# EAGLE design Zeitschalter_vertikal_SMD (EAGLE 7.2.0)
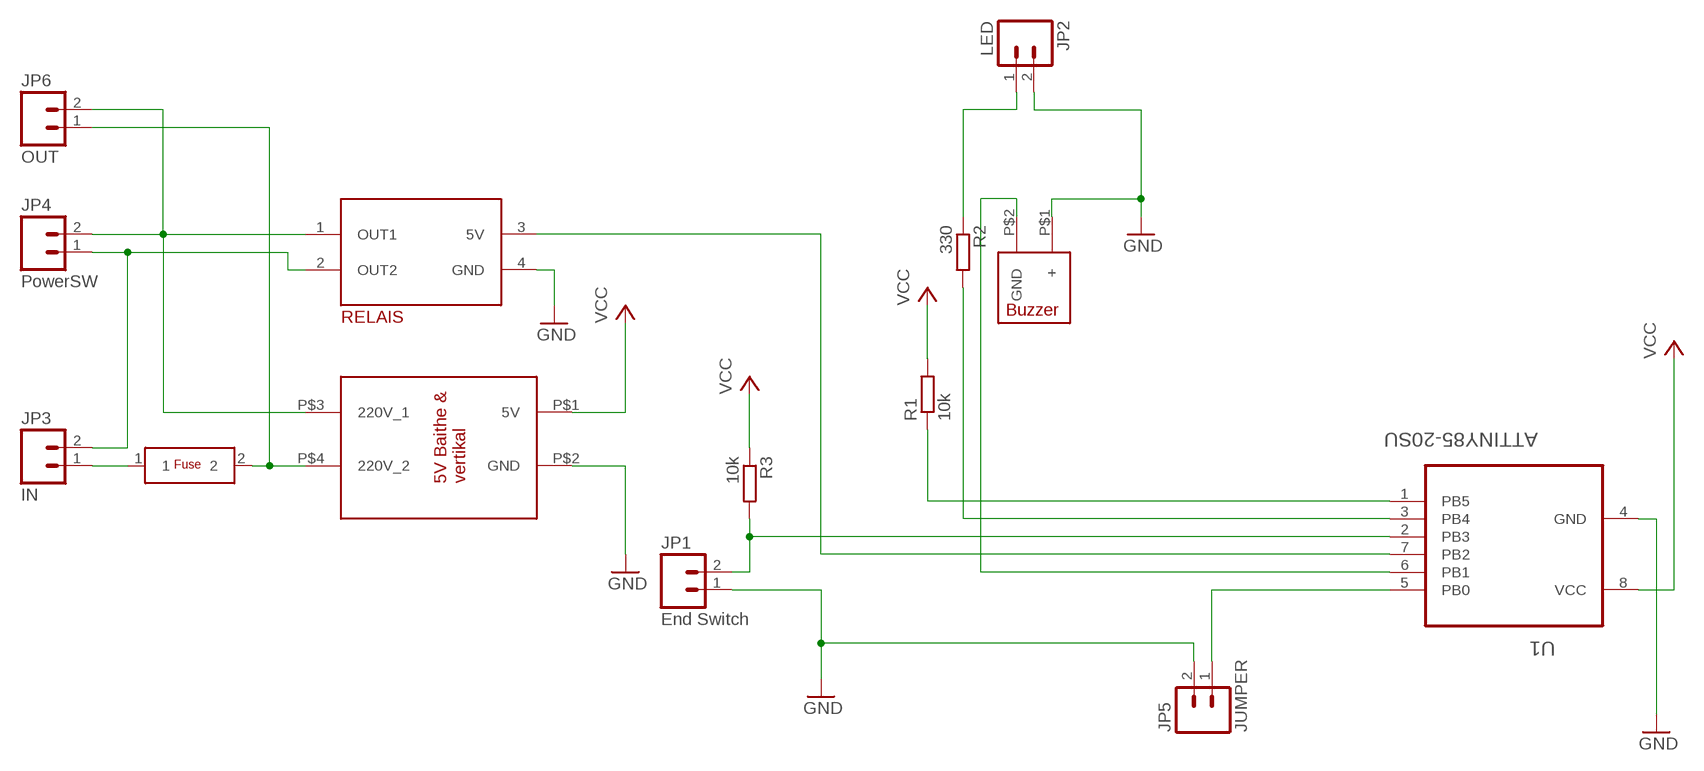
[diagram p0: schematic, sheet 1]

## Parts
FUSE  FUSE  FUSE_RESETABLE  [FUSE_RESETABLE]
JP1  End Switch  M02LOCK_LONGPADS  [1X02_LOCK_LONGPADS]
JP2  LED  M02LOCK_LONGPADS  [1X02_LOCK_LONGPADS]
JP3  IN  M025MM  [SCREWTERMINAL-5MM-2]
JP4  PowerSW  M02LOCK_LONGPADS  [1X02_LOCK_LONGPADS]
JP5  JUMPER  M02LOCK_LONGPADS  [1X02_LOCK_LONGPADS]
JP6  OUT  M025MM  [SCREWTERMINAL-5MM-2]
R1  10k  R-EU_M1206  [M1206]
R2  330  R-EU_M1206  [M1206]
R3  10k  R-EU_M1206  [M1206]
U1  ATTINY85-20SU  [SOIC127P798X216-8N]
U$1  NETZTEIL_VERTIKAL_5V  [NETZTEIL_VERTIKAL_5V]
U$2  OMRON-G3MB-202P  [OMRON-G3MB-202P]
U$3  BUZZER  [BUZZER]

## Nets
GND: JP1.1 JP2.2 JP5.2 U1.4(GND) U$1.P$2(GND) U$2.4(GND) U$3.P$1(+)
N$1 [220V]: FUSE.1 JP3.1
N$2 [220V]: JP4.2 JP6.2 U$1.P$3(220V_1) U$2.1(OUT1)
N$3: R2.2 U1.3(PB4)
N$4: JP1.2 R3.2 U1.2(PB3)
N$5: JP5.1 U1.5(PB0)
N$10 [220V]: FUSE.2 JP6.1 U$1.P$4(220V_2)
N$11: R1.1 U1.1(PB5)
N$13: JP2.1 R2.1
N$14: U1.6(PB1) U$3.P$2(GND)
N$15: U1.7(PB2) U$2.3(5V)
N$17 [220V]: JP3.2 JP4.1 U$2.2(OUT2)
VCC: R1.2 R3.1 U1.8(VCC) U$1.P$1(5V)

## Library data of the parts
FUSE = ASP_Library:FUSE_RESETABLE
JP1 JP2 JP4 JP5 = SparkFun-Connectors:M02: Standard 2-pin 0.1" header. Use with - straight break away headers ( PRT-00116) - right angle break away headers (PRT-00553) - swiss pins (PRT-00743) - machine pins (PRT-00117) - female headers (PRT-00115) Molex polarized connector foot print use with: PRT-08233 with associated crimp pins and housings. 2.54_SCREWTERM for use with PRT-10571. 3.5mm Screw Terminal footprints for PRT-08084 5mm Screw Terminal footprints for use with PRT-08432
JP3 JP6 = ASP_Library:M02: Standard 2-pin 0.1" header. Use with - straight break away headers ( PRT-00116) - right angle break away headers (PRT-00553) - swiss pins (PRT-00743) - machine pins (PRT-00117) - female headers (PRT-00115) Molex polarized connector foot print use with: PRT-08233 with associated crimp pins and housings. 2.54_SCREWTERM for use with PRT-10571. 3.5mm Screw Terminal footprints for PRT-08084 5mm Screw Terminal footprints for use with PRT-08432; STOREFRONT_ID: PRT-08432
R1-R3 = rcl:R-EU_: RESISTOR, European symbol
U1 = Atmel_By_element14_Batch_1-00:ATTINY85-20SU: 8-bit Microcontroller with In-System Programmable Flash; MPN: ATTINY85-20SU; OC_FARNELL: 1455164; OC_NEWARK: 58M3797; PACKAGE: SOIC-8; SUPPLIER: Atmel
U$1 = ASP_Library:NETZTEIL_VERTIKAL_5V
U$2 = ASP_Library:OMRON-G3MB-202P
U$3 = ASP_Library:BUZZER

## Net classes
1 220V: width 0.762 mm, clearance 0.762 mm

## Board
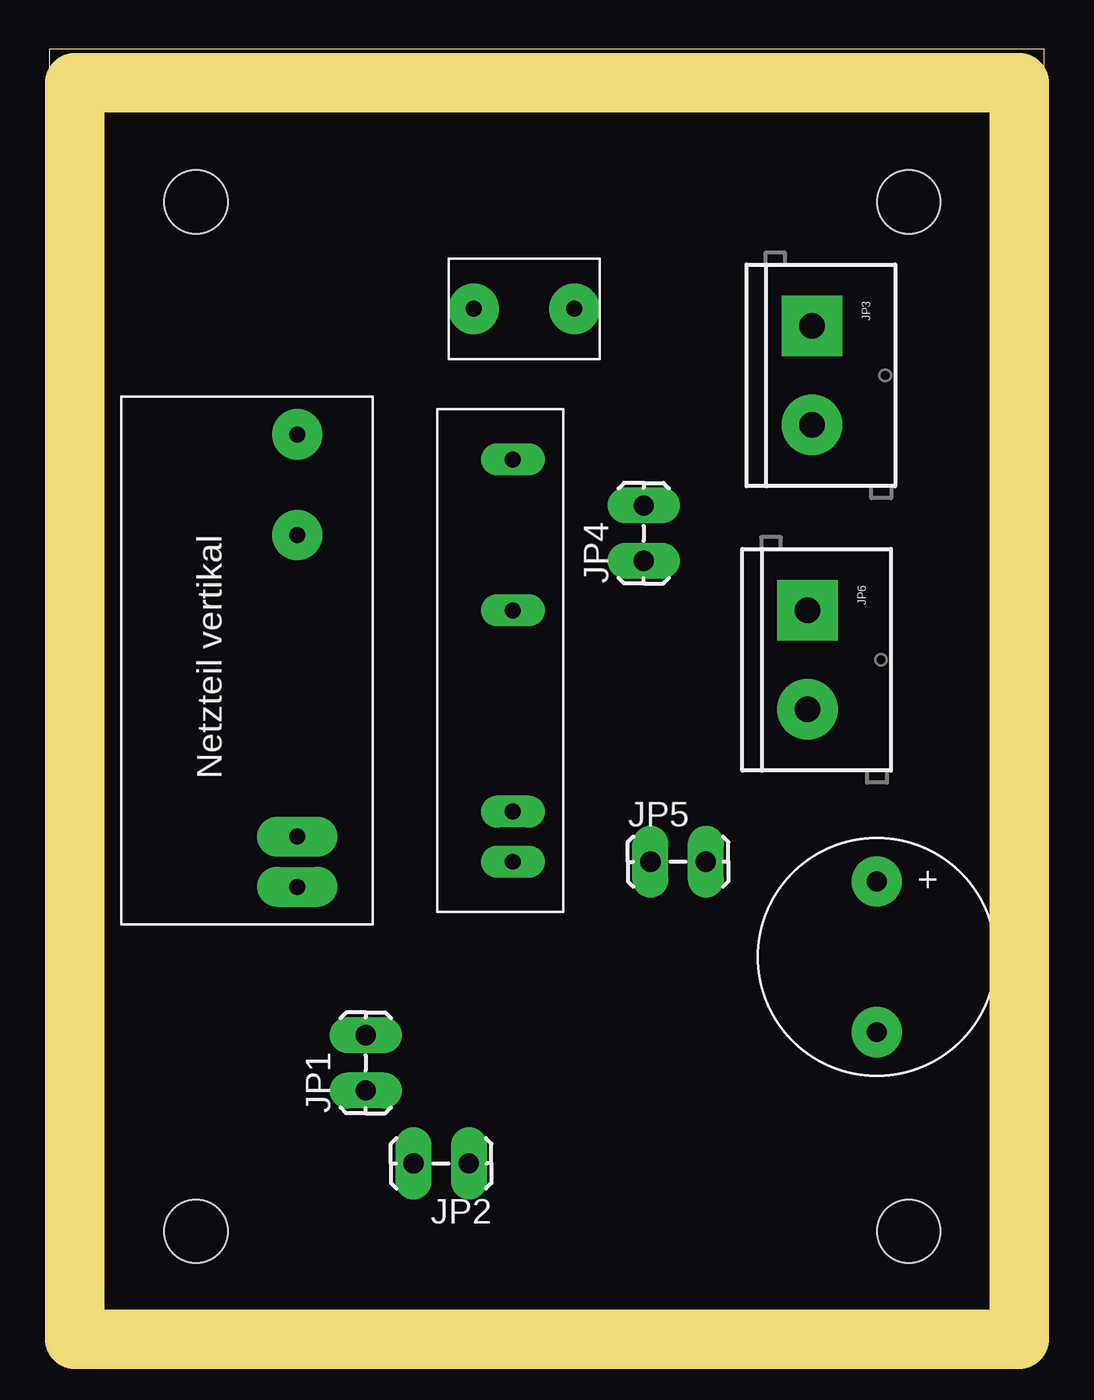
[diagram p1: board, top side]
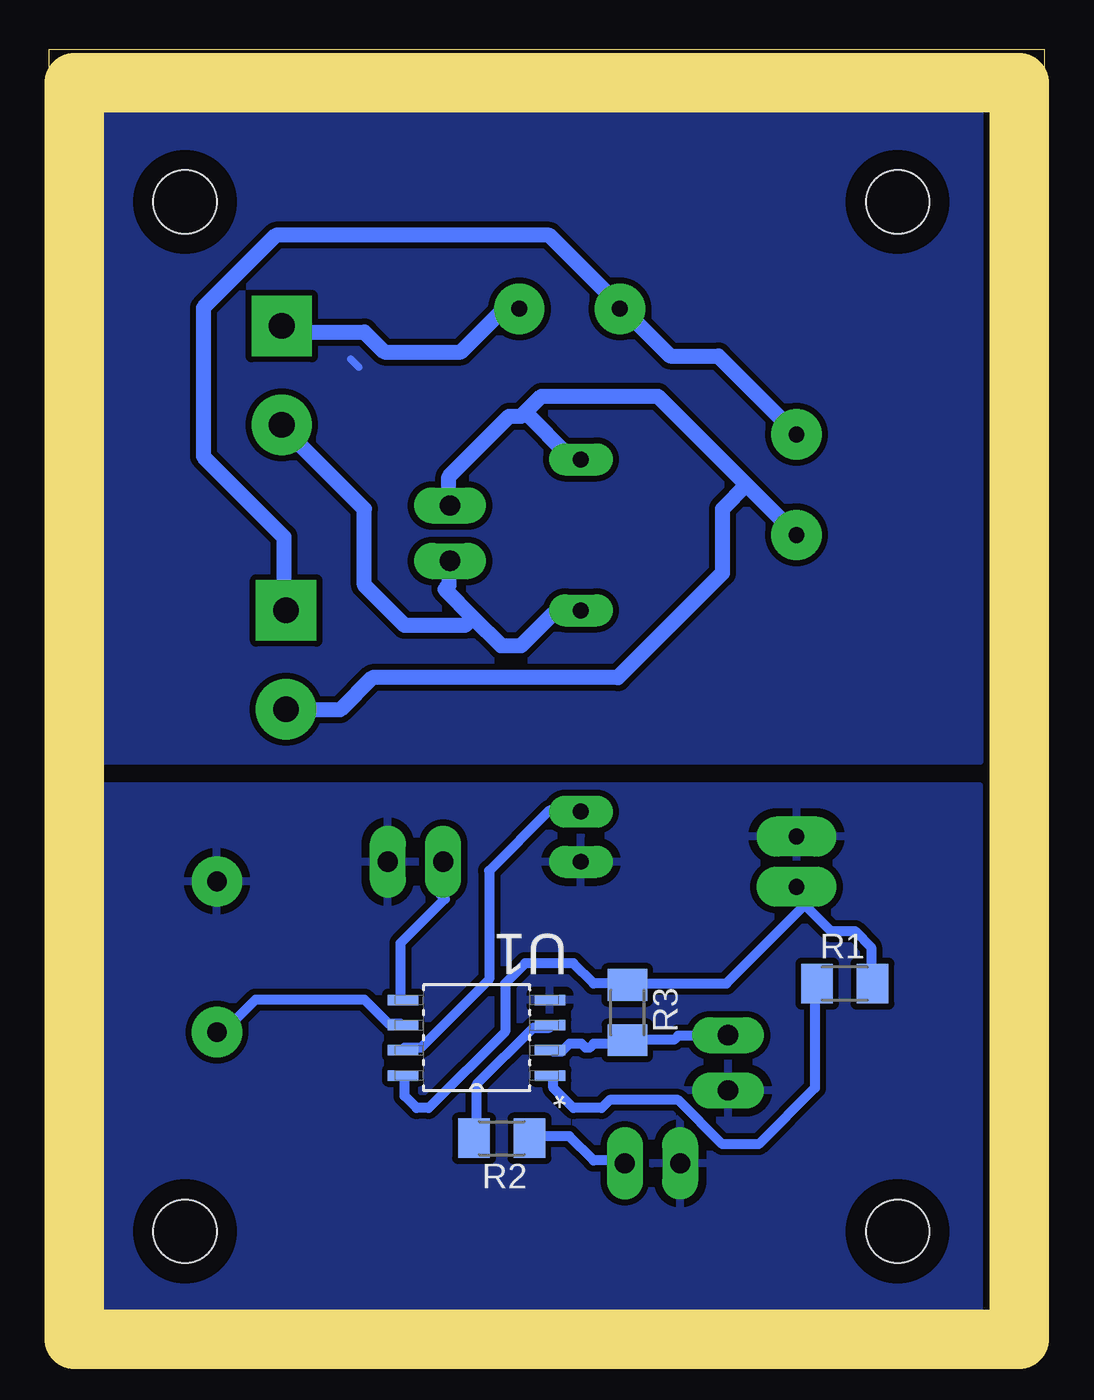
[diagram p2: board, bottom side, seen from below]

Size 50.24 x 65.71 mm. Coordinates in mm from the lower left corner, seen from the top.
Outline: 0,0 50.24,0 50.24,65.71 0,65.71 0,0
Copper layers (1*16): Top 0.035mm / dielectric 1.5mm / Bottom 0.035mm
Design rules "default *": minimum track width 20mil, minimum drill 31mil, track to track 12mil, track to pad 12mil, pad to pad 12mil, via to via 12mil, smd to smd 8mil, copper to edge 40mil, drill to drill 8mil, minimum pad ring 16mil, minimum via ring 8mil, stop-mask expansion 4mil, vias tented up to drill 0mil, thermal gap 16mil
Holes 3.2 mm at 7.4,58 43.4,58 43.4,6 7.4,6
Milling: 4 lines

### Footprints (pad centres in the part's own frame; a part is rotated, then mirrored left to right if it is on the bottom)
FUSE_RESETABLE = drill 0.8 pad 2.54: 1 -2.54,0; 2 2.54,0
1X02_LOCK_LONGPADS = drill 1.016 long: 1 -0.127,0; 2 2.667,0
SCREWTERMINAL-5MM-2 = drill 1.3 pad 3.048 square: 1 0,0 | drill 1.3 pad 3.048: 2 5,0
M1206 = smd 1.6 x 2: 1 -1.4,0; 2 1.4,0
SOIC127P798X216-8N = smd 1.549 x 0.533: 1 -3.708,1.905; 2 -3.708,0.635; 3 -3.708,-0.635; 4 -3.708,-1.905; 5 3.708,-1.905; 6 3.708,-0.635; 7 3.708,0.635; 8 3.708,1.905
NETZTEIL_VERTIKAL_5V = drill 0.8 pad 2.032 long: P$1 12.7,2.54; P$2 10.16,2.54 | drill 0.8 pad 2.54: P$3 -5.08,2.54; P$4 -10.16,2.54
OMRON-G3MB-202P = drill 0.8 long: 1 0,-10.16; 2 0,-2.54; 3 0,7.62; 4 0,10.16
BUZZER = drill 1 pad 2.54: P$1 -3.81,0; P$2 3.81,0

### Placement (x,y rotation side)
FUSE  23.97,52.61 180 top
JP1  15.97,13.24 90 top
JP2  21.05,9.43 180 top
JP3  38.51,51.74 270 top
JP4  30.01,40 90 top
JP5  30.48,24.67 0 top
JP6  38.29,37.37 270 top
R1  10.07,18.51 0 bottom
R2  27.4,10.7 180 bottom
R3  21.05,17.05 270 bottom
U1  28.67,15.78 180 bottom
U$1  9.97,36.1 270 top
U$2  23.4,34.83 180 top
U$3  41.78,19.87 270 top

### Tracks (layer width: path | path; a pad name or v marks a point on that pad's centre or on a via)
GND
  pour Bottom: 3.27,28.48 47.72,28.48 47.72,1.81 3.27,1.81
N$1
  Bottom 0.762: FUSE.1 26.62,52.46 27.43,52.46 29.46,50.43 33.32,50.43 34.34,51.44 38.2,51.44 38.41,51.65 JP3.1
N$2
  Bottom 0.762: 26.21,47.38 23.98,45.14 23.57,45.14 U$2.1 | 26.21,47.38 26.42,47.17 27.03,47.17 30.07,44.13 30.07,42.7 JP4.2 | 15.04,43.72 19.51,48.19 25.4,48.19 26.21,47.38 | 15.04,43.72 12.6,41.28 U$1.P$3 | 15.04,43.72 16.26,42.5 16.26,39.25 21.54,33.97 33.93,33.97 35.56,32.34 38.2,32.34 JP6.2
N$3
  Bottom 0.508: U1.3 24.99,16.29 25.81,16.29 28.65,13.44 28.65,10.8 R2.2
N$4
  Bottom 0.508: U1.2 24.79,15.07 24.38,15.07 23.98,15.48 23.37,15.48 23.16,15.27 22.96,15.27 22.76,15.48 21.13,15.48 R3.2 20.93,15.68 18.69,15.68 18.49,15.88 16.05,15.88 JP1.2
N$5
  Bottom 0.508: U1.5 32.51,17.71 32.51,20.55 30.28,22.79 30.48,22.99 30.48,24.62 JP5.1
N$10
  Bottom 0.762: U$1.P$4 12.6,46.36 16.46,50.22 18.9,50.22 21.34,52.66 FUSE.2 21.54,52.86 24.99,56.32 38.81,56.32 42.47,52.66 42.47,45.14 38.41,41.08 38.41,37.42 JP6.1
N$11
  Bottom 0.508: U1.1 24.79,13.85 24.79,13.24 23.77,12.22 22.35,12.22 21.95,12.63 18.49,12.63 16.26,10.39 14.43,10.39 11.58,13.24 11.58,18.32 R1.1
N$12
  Bottom 0.381: 35.02,50.07 34.61,49.66
  pour Bottom: 3.27,29.75 47.72,29.75 47.72,62.77 3.27,62.77
N$13
  Bottom 0.508: R2.1 25.81,10.8 23.98,10.8 22.76,9.58 21.34,9.58 JP2.1
N$14
  Bottom 0.508: U1.6 32.51,16.49 33.12,16.49 34.34,17.71 39.83,17.71 41.66,15.88 U$3.P$2
N$15
  Bottom 0.508: U1.7 32.31,15.27 31.5,15.27 28.04,18.73 28.04,24.21 24.99,27.26 23.57,27.26 U$2.3
N$17
  Bottom 0.762: 28.85,37.01 30.28,38.44 30.07,38.64 30.07,39.86 JP4.1 | 28.85,37.01 27.43,35.59 26.42,35.59 24.79,37.22 23.57,37.22 U$2.2 | JP3.2 38.41,46.56 34.34,42.5 34.34,38.64 32.31,36.61 29.26,36.61 28.85,37.01
VCC
  Bottom 0.508: 12.09,22.49 12.39,22.79 12.39,23.4 U$1.P$1 | 12.09,22.49 10.77,21.16 9.55,21.16 8.74,20.35 8.74,18.52 R1.2 | 32.51,13.85 U1.8 32.31,13.65 32.31,12.83 31.7,12.22 31.09,12.22 27.23,16.09 27.23,18.52 26.21,19.54 23.77,19.54 22.76,18.52 21.13,18.52 R3.1 20.93,18.52 16.05,18.52 12.09,22.49